# Altium project MainBoard_V2.PrjPcb
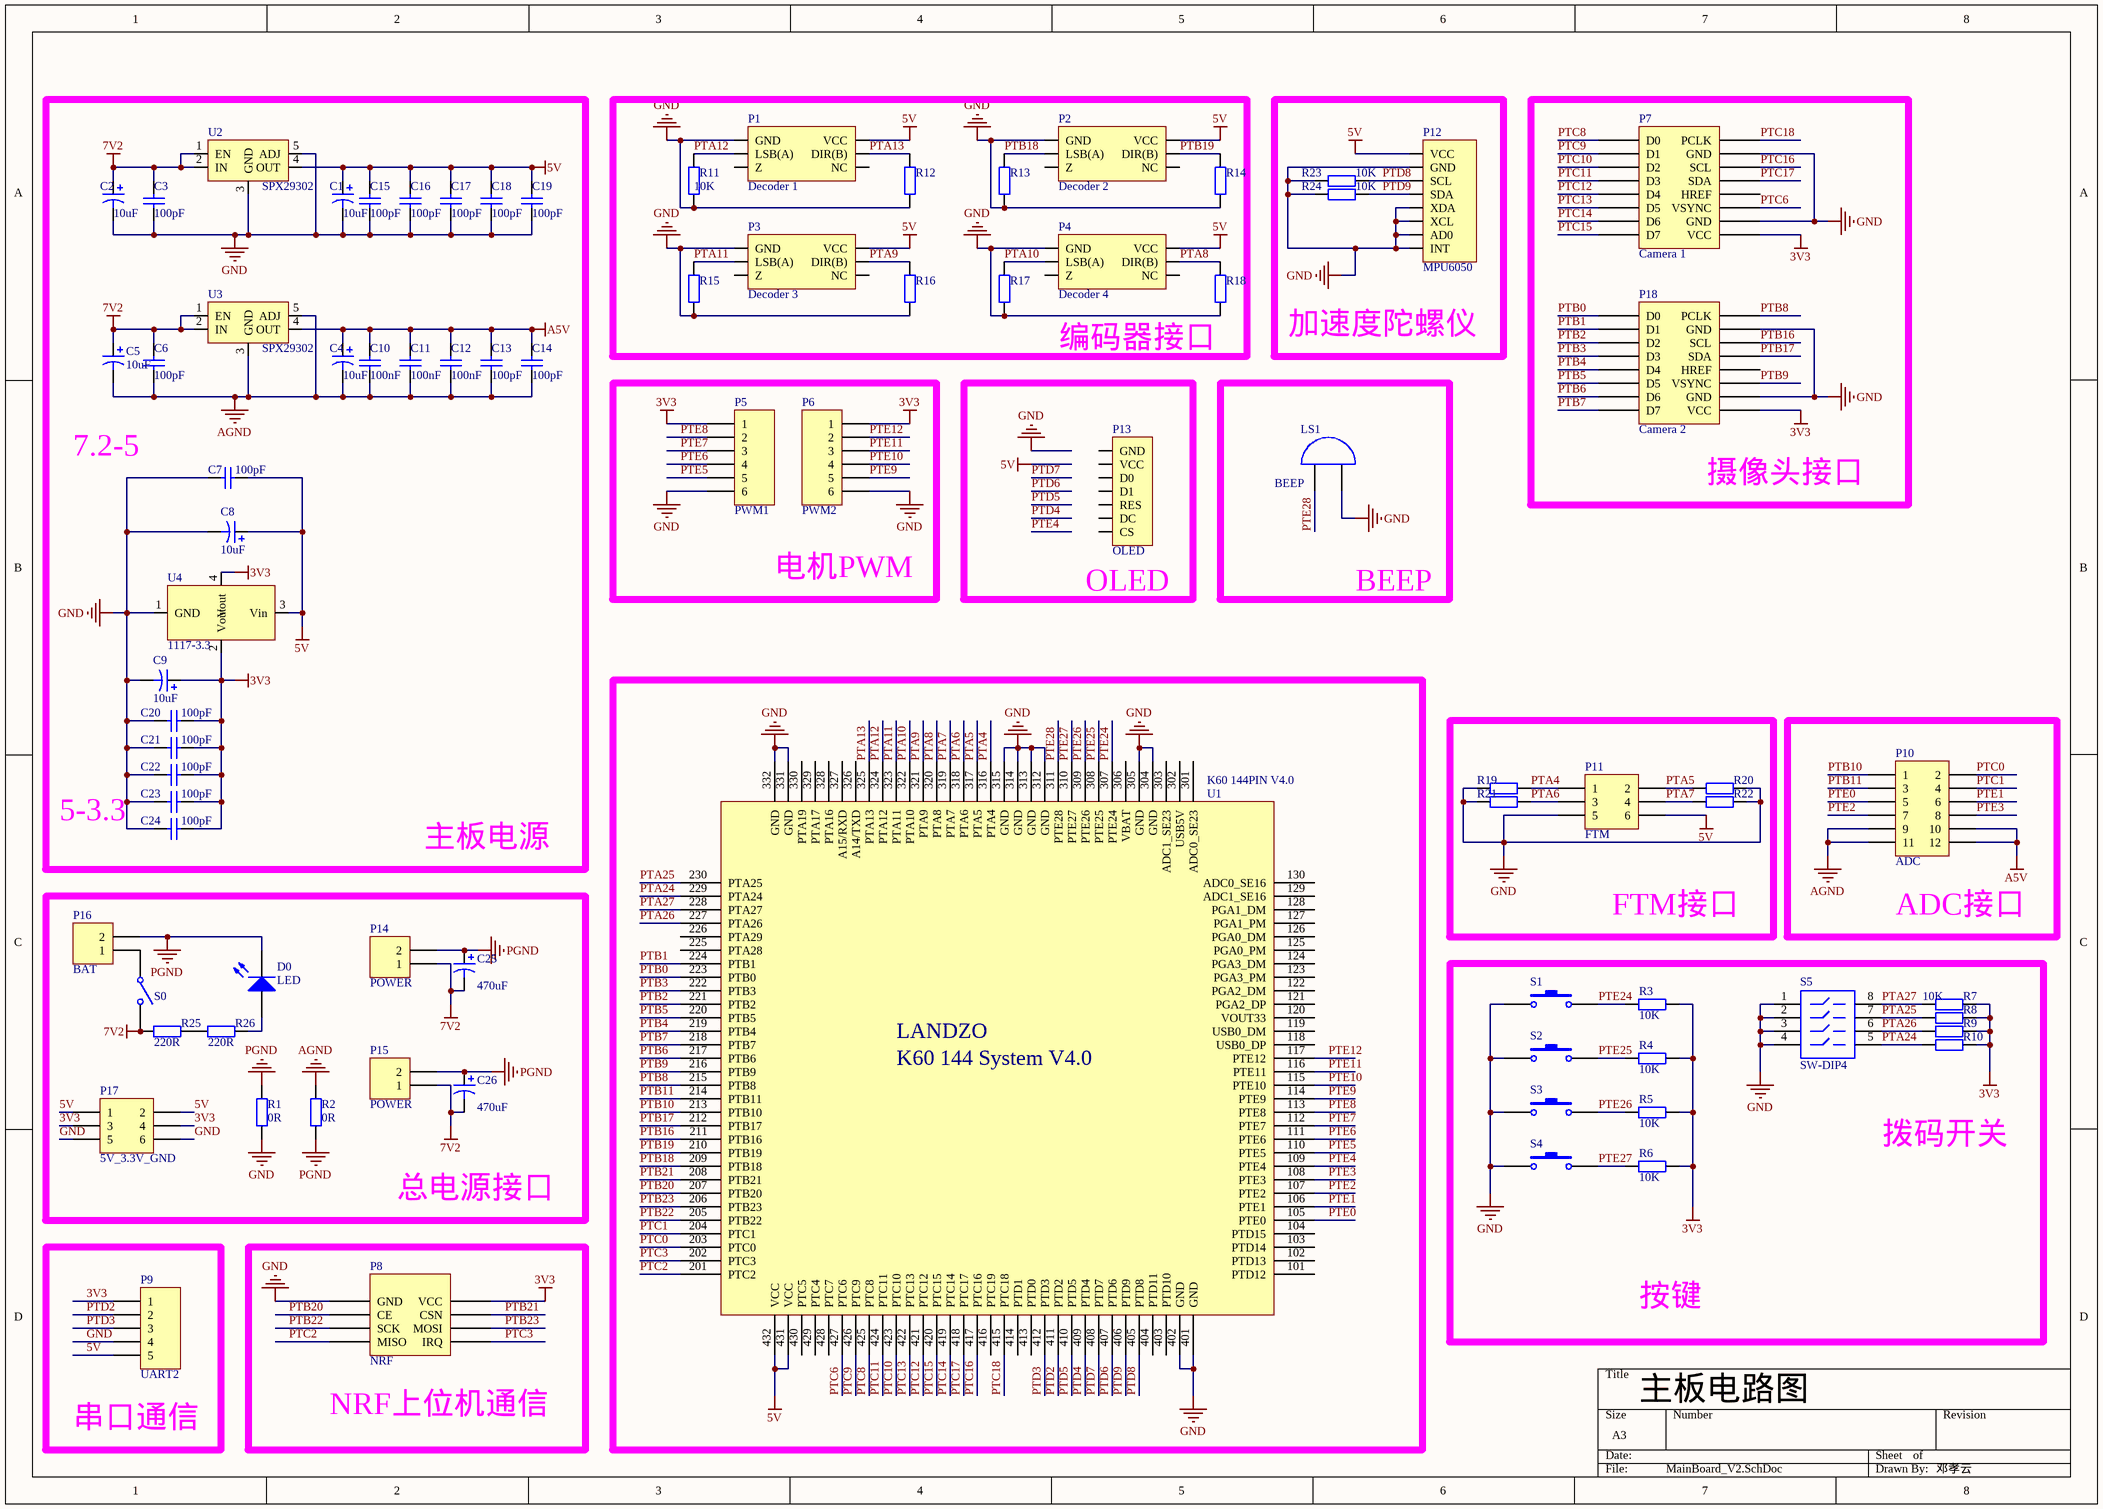
[diagram p0: MainBoard_V2.SchDoc]
1 sheet, 82 parts. Net scope: global (net labels, ports and power ports of the same name join across sheets).
Board file: MainBoard_V2.PcbDoc

## Sheet MainBoard_V2.SchDoc
size A3; PageSetup: Record=PageOptions|CenterHorizontal=True|CenterVertical=True|PrintScale=1.00|XCorrection=1.00|YCorrection=1.00|PrintKind=1|BorderSize=5000000|LeftOffset=0|BottomOffset=0|Orientation=2|PaperLength=1000|PaperWidth=1000|Scale=100|PaperSource=7|PrintQuality=-3|MediaType=1|DitherType=10|PrintScaleMode=0|PaperKind=A4|PaperIndex=9

### Parts
C1  value 10uF  [1206 C tan]  (hidden comment: Cap Pol1)
C2  value 10uF  [1206 C tan]  (hidden comment: Cap Pol1)
C3  value 100pF  [1206 C]  (hidden comment: Cap Semi)
C4  value 10uF  [1206 C tan]  (hidden comment: Cap Pol1)
C5  value 10uF  [1206 C tan]  (hidden comment: Cap Pol1)
C6  value 100pF  [1206 C]  (hidden comment: Cap Semi)
C7  value 100pF  [1206 C]  (hidden comment: Cap Semi)
C8  value 10uF  [1206 C tan]  (hidden comment: Cap Pol1)
C9  value 10uF  [1206 C tan]  (hidden comment: Cap Pol1)
C10  value 100nF  [0805 C]  (hidden comment: Cap)
C11  value 100nF  [0805 C]  (hidden comment: Cap)
C12  value 100nF  [0805 C]  (hidden comment: Cap)
C13  value 100pF  [0805 C]  (hidden comment: Cap)
C14  value 100pF  [0805 C]  (hidden comment: Cap)
C15  value 100pF  [0805 C]  (hidden comment: Cap)
C16  value 100pF  [0805 C]  (hidden comment: Cap)
C17  value 100pF  [0805 C]  (hidden comment: Cap)
C18  value 100pF  [0805 C]  (hidden comment: Cap)
C19  value 100pF  [0805 C]  (hidden comment: Cap)
C20  value 100pF  [0805 C]  (hidden comment: Cap)
C21  value 100pF  [0805 C]  (hidden comment: Cap)
C22  value 100pF  [0805 C]  (hidden comment: Cap)
C23  value 100pF  [0805 C]  (hidden comment: Cap)
C24  value 100pF  [0805 C]  (hidden comment: Cap)
C25  value 470uF  [C pol]  (hidden comment: Cap Pol1)
C26  value 470uF  [C pol]  (hidden comment: Cap Pol1)
D0  LED  [0805 D]
K60_144PIN_V4.0  U1  [K60 V4.0]
LS1  BEEP  [BEEP]
P1  Decoder 1  [BigHeader P3*2]
P2  Decoder 2  [BigHeader P3*2]
P3  Decoder 3  [BigHeader P3*2]
P4  Decoder 4  [BigHeader P3*2]
P5  PWM1  [Header P6]
P6  PWM2  [Header P6]
P7  Camera 1  [FHeader P8*2]
P8  NRF  [NRF]
P9  UART2  [Header P5]
P10  ADC  [Header P6*2]
P11  FTM  [Header P3*2]
P12  MPU6050  [MPU6050]
P13  OLED  [OLED P7]
P14  POWER  [Connect 050-2]
P15  POWER  [Connect 050-2]
P16  BAT  [Connect 050-2]
P17  5V_3.3V_GND  [Header P3*2]
P18  Camera 2  [FHeader P8*2]
R1  value 0R  [1206 R]  (hidden comment: Res2)
R2  value 0R  [1206 R]  (hidden comment: Res2)
R3  value 10K  [0805 R]  (hidden comment: Res2)
R4  value 10K  [0805 R]  (hidden comment: Res2)
R5  value 10K  [0805 R]  (hidden comment: Res2)
R6  value 10K  [0805 R]  (hidden comment: Res2)
R7  value 10K  [0805 R]  (hidden comment: Res2)
R8  Res2  [0805 R]  (value not drawn)
R9  Res2  [0805 R]  (value not drawn)
R10  Res2  [0805 R]  (value not drawn)
R11  value 10K  [0805 R]  (hidden comment: Res2)
R12  Res2  [0805 R]  (value not drawn)
R13  Res2  [0805 R]  (value not drawn)
R14  Res2  [0805 R]  (value not drawn)
R15  Res2  [0805 R]  (value not drawn)
R16  Res2  [0805 R]  (value not drawn)
R17  Res2  [0805 R]  (value not drawn)
R18  Res2  [0805 R]  (value not drawn)
R19  Res2  [0805 R]  (value not drawn)
R20  Res2  [0805 R]  (value not drawn)
R21  Res2  [0805 R]  (value not drawn)
R22  Res2  [0805 R]  (value not drawn)
R23  value 10K  [0805 R]  (hidden comment: Res2)
R24  value 10K  [0805 R]  (hidden comment: Res2)
R25  value 220R  [0805 R]  (hidden comment: Res2)
R26  value 220R  [0805 R]  (hidden comment: Res2)
S0  SW-SPST  [Switch]  (value not drawn)
S1  SW-PB  [Touch Switch]  (value not drawn)
S2  SW-PB  [Touch Switch]  (value not drawn)
S3  SW-PB  [Touch Switch]  (value not drawn)
S4  SW-PB  [Touch Switch]  (value not drawn)
S5  SW-DIP4  [DIP-8]
U2  SPX29302  [To-263-5]
U3  SPX29302  [To-263-5]
U4  1117-3.3  [SOT223_M]

### Blocks framed on the sheet
编码器接口: P1-P4 R11-R18
加速度陀螺仪: P12 R23 R24
摄像头接口: P7 P18
电机PWM: P5 P6
OLED: P13
BEEP: LS1
FTM接口: P11 R19-R22
ADC接口: P10
总电源接口: C25 C26 D0 P14-P17 R1 R2 R25 R26 S0
串口通信: P9
NRF上位机通信: P8

### Nets
3V3: C9.1 C20.2 C21.2 C22.2 C23.2 C24.2 P5.1 P6.1 P7.9(VCC) P8.8(VCC) P9.1 P17.3 P17.4 P18.9(VCC) R3.2 R4.2 R5.2 R6.2 R7.2 R8.2 R9.2 R10.2 U4.2(Vout) U4.4(Vout)
5V: C1.1 C7.2 C8.1 C15.2 C16.2 C17.2 C18.2 C19.2 K60_144PIN_V4.0.431(VCC) K60_144PIN_V4.0.432(VCC) P1.2(VCC) P2.2(VCC) P3.2(VCC) P4.2(VCC) P9.5 P11.6 P12.1(VCC) P17.1 P17.2 U2.4(OUT) U4.3(Vin)
7V2: C2.1 C3.2 C5.1 C6.2 C25.2 C26.2 P14.1 P15.1 R25.1 S0.2(NO) U2.1(EN) U2.2(IN) U3.1(EN) U3.2(IN)
A5V: C4.1 C10.2 C11.2 C12.2 C13.2 C14.2 P10.10 P10.12 U3.4(OUT)
AGND: C4.2 C5.2 C6.1 C10.1 C11.1 C12.1 C13.1 C14.1 P10.9 P10.11 R2.2 U3.3(GND) U3.5(ADJ)
GND: C1.2 C2.2 C3.1 C7.1 C8.2 C9.2 C15.1 C16.1 C17.1 C18.1 C19.1 C20.1 C21.1 C22.1 C23.1 C24.1 K60_144PIN_V4.0.304(GND) K60_144PIN_V4.0.305(GND) K60_144PIN_V4.0.312(GND) K60_144PIN_V4.0.313(GND) K60_144PIN_V4.0.314(GND) K60_144PIN_V4.0.315(GND) K60_144PIN_V4.0.331(GND) K60_144PIN_V4.0.332(GND) K60_144PIN_V4.0.401(GND) K60_144PIN_V4.0.402(GND) LS1.2(B) P1.1(GND) P2.1(GND) P3.1(GND) P4.1(GND) P5.6 P6.6 P7.10(GND) P7.15(GND) P8.1(GND) P9.4 P11.5 P12.2(GND) P12.5(XDA) P12.6(XCL) P12.7(AD0) P12.8(INT) P17.5 P17.6 P18.10(GND) P18.15(GND) R1.1 R11.1 R12.1 R13.1 R14.1 R15.1 R16.1 R17.1 R18.1 R19.1 R20.2 R21.1 R22.2 R23.1 R24.1 S1.1 S2.1 S3.1 S4.1 S5.1 S5.2 S5.3 S5.4 U2.3(GND) U2.5(ADJ) U4.1(GND)
PGND: C25.1 C26.1 D0.2(K) P14.2 P15.2 P16.2 R1.2 R2.1
PTA4: K60_144PIN_V4.0.316(PTA4) P11.1 R19.2
PTA5: K60_144PIN_V4.0.317(PTA5) P11.2 R20.1
PTA6: K60_144PIN_V4.0.318(PTA6) P11.3 R21.2
PTA7: K60_144PIN_V4.0.319(PTA7) P11.4 R22.1
PTA8: K60_144PIN_V4.0.320(PTA8) P4.4(DIR(B)) R18.2
PTA9: K60_144PIN_V4.0.321(PTA9) P3.4(DIR(B)) R16.2
PTA10: K60_144PIN_V4.0.322(PTA10) P4.3(LSB(A)) R17.2
PTA11: K60_144PIN_V4.0.323(PTA11) P3.3(LSB(A)) R15.2
PTA12: K60_144PIN_V4.0.324(PTA12) P1.3(LSB(A)) R11.2
PTA13: K60_144PIN_V4.0.325(PTA13) P1.4(DIR(B)) R12.2
PTA24: K60_144PIN_V4.0.229(PTA24) R10.1 S5.5
PTA25: K60_144PIN_V4.0.230(PTA25) R8.1 S5.7
PTA26: K60_144PIN_V4.0.227(PTA26) R9.1 S5.6
PTA27: K60_144PIN_V4.0.228(PTA27) R7.1 S5.8
PTB0: K60_144PIN_V4.0.223(PTB0) P18.1(D0)
PTB1: K60_144PIN_V4.0.224(PTB1) P18.2(D1)
PTB2: K60_144PIN_V4.0.221(PTB2) P18.3(D2)
PTB3: K60_144PIN_V4.0.222(PTB3) P18.4(D3)
PTB4: K60_144PIN_V4.0.219(PTB4) P18.5(D4)
PTB5: K60_144PIN_V4.0.220(PTB5) P18.6(D5)
PTB6: K60_144PIN_V4.0.217(PTB6) P18.7(D6)
PTB7: K60_144PIN_V4.0.218(PTB7) P18.8(D7)
PTB8: K60_144PIN_V4.0.215(PTB8) P18.16(PCLK)
PTB9: K60_144PIN_V4.0.216(PTB9) P18.11(VSYNC)
PTB10: K60_144PIN_V4.0.213(PTB10) P10.1
PTB11: K60_144PIN_V4.0.214(PTB11) P10.3
PTB16: K60_144PIN_V4.0.211(PTB16) P18.14(SCL)
PTB17: K60_144PIN_V4.0.212(PTB17) P18.13(SDA)
PTB18: K60_144PIN_V4.0.209(PTB18) P2.3(LSB(A)) R13.2
PTB19: K60_144PIN_V4.0.210(PTB19) P2.4(DIR(B)) R14.2
PTB20: K60_144PIN_V4.0.207(PTB20) P8.2(CE)
PTB21: K60_144PIN_V4.0.208(PTB21) P8.7(CSN)
PTB22: K60_144PIN_V4.0.205(PTB22) P8.3(SCK)
PTB23: K60_144PIN_V4.0.206(PTB23) P8.6(MOSI)
PTC0: K60_144PIN_V4.0.203(PTC0) P10.2
PTC1: K60_144PIN_V4.0.204(PTC1) P10.4
PTC2: K60_144PIN_V4.0.201(PTC2) P8.4(MISO)
PTC3: K60_144PIN_V4.0.202(PTC3) P8.5(IRQ)
PTC6: K60_144PIN_V4.0.427(PTC6) P7.11(VSYNC)
PTC8: K60_144PIN_V4.0.425(PTC8) P7.1(D0)
PTC9: K60_144PIN_V4.0.426(PTC9) P7.2(D1)
PTC10: K60_144PIN_V4.0.423(PTC10) P7.3(D2)
PTC11: K60_144PIN_V4.0.424(PTC11) P7.4(D3)
PTC12: K60_144PIN_V4.0.421(PTC12) P7.5(D4)
PTC13: K60_144PIN_V4.0.422(PTC13) P7.6(D5)
PTC14: K60_144PIN_V4.0.419(PTC14) P7.7(D6)
PTC15: K60_144PIN_V4.0.420(PTC15) P7.8(D7)
PTC16: K60_144PIN_V4.0.417(PTC16) P7.14(SCL)
PTC17: K60_144PIN_V4.0.418(PTC17) P7.13(SDA)
PTC18: K60_144PIN_V4.0.415(PTC18) P7.16(PCLK)
PTD2: K60_144PIN_V4.0.411(PTD2) P9.2
PTD3: K60_144PIN_V4.0.412(PTD3) P9.3
PTD4: K60_144PIN_V4.0.409(PTD4)
PTD5: K60_144PIN_V4.0.410(PTD5)
PTD6: K60_144PIN_V4.0.407(PTD6)
PTD7: K60_144PIN_V4.0.408(PTD7)
PTD8: K60_144PIN_V4.0.405(PTD8) P12.3(SCL) R23.2
PTD9: K60_144PIN_V4.0.406(PTD9) P12.4(SDA) R24.2
PTE0: K60_144PIN_V4.0.105(PTE0) P10.5
PTE1: K60_144PIN_V4.0.106(PTE1) P10.6
PTE2: K60_144PIN_V4.0.107(PTE2) P10.7
PTE3: K60_144PIN_V4.0.108(PTE3) P10.8
PTE4: K60_144PIN_V4.0.109(PTE4)
PTE5: K60_144PIN_V4.0.110(PTE5) P5.5
PTE6: K60_144PIN_V4.0.111(PTE6) P5.4
PTE7: K60_144PIN_V4.0.112(PTE7) P5.3
PTE8: K60_144PIN_V4.0.113(PTE8) P5.2
PTE9: K60_144PIN_V4.0.114(PTE9) P6.5
PTE10: K60_144PIN_V4.0.115(PTE10) P6.4
PTE11: K60_144PIN_V4.0.116(PTE11) P6.3
PTE12: K60_144PIN_V4.0.117(PTE12) P6.2
PTE24: K60_144PIN_V4.0.307(PTE24) R3.1 S1.2
PTE25: K60_144PIN_V4.0.308(PTE25) R4.1 S2.2
PTE26: K60_144PIN_V4.0.309(PTE26) R5.1 S3.2
PTE27: K60_144PIN_V4.0.310(PTE27) R6.1 S4.2
PTE28: K60_144PIN_V4.0.311(PTE28) LS1.1(A)
NetD0_1: D0.1(A) R26.2
NetP16_1: P16.1 S0.1(COMMON)
NetR25_2: R25.2 R26.1

Not connected (* = marked no-connect by the designer): K60_144PIN_V4.0 101(PTD12) 102(PTD13) 103(PTD14) 104(PTD15) 118(USB0_DP) 119(USB0_DM) 120(VOUT33) 121(PGA2_DP) 122(PGA2_DM) 123(PGA3_PM) 124(PGA3_DM) 125(PGA0_PM) 126(PGA0_DM) 127(PGA1_PM) 128(PGA1_DM) 129(ADC1_SE16) 130(ADC0_SE16) 225(PTA28) 226(PTA29) 301(ADC0_SE23) 302(USB5V) 303(ADC1_SE23) 306(VBAT) 326(A14/TXD) 327(A15/RXD) 328(PTA16) 329(PTA17) 330(PTA19) 403(PTD10) 404(PTD11) 413(PTD0) 414(PTD1) 416(PTC19) 428(PTC7) 429(PTC4) 430(PTC5); P1 5(Z) 6(NC); P2 5(Z) 6(NC); P3 5(Z) 6(NC); P4 5(Z) 6(NC); P7 12(HREF); P13 1(GND) 2(VCC) 3(D0) 4(D1) 5(RES) 6(DC) 7(CS); P18 12(HREF)

### Notes on the sheet
- 7.2-5
- 5-3.3
- 主板电源
- 拨码开关
- 按键
- 主板电路图
- 邓孝云
- (in symbol K60 144PIN V4.0系统板) LANDZO; K60 144 System V4.0

### Library data of the parts
C1 C2 C4 C5 C8 C9 C25 C26 = Cap Pol1: Polarized Capacitor (Radial); Published: 8-Jun-2000; LatestRevisionDate: 17-Jul-2002; LatestRevisionNote: Re-released for DXP Platform.; PackageReference: RB7.6-15; Publisher: Altium Limited; PackageDescription: Polarized Capacitor (Radial); 2 Leads
C3 C6 C7 = Cap Semi: Capacitor (Semiconductor SIM Model); Published: 8-Jun-2000; LatestRevisionDate: 29-May-2009; LatestRevisionNote: IPC-7351 Footprint Added.; PackageReference: C1206; Publisher: Altium Limited; PackageDescription: Chip Capacitor
C10-C24 = Cap: Capacitor; Published: 8-Jun-2000; LatestRevisionDate: 17-Jul-2002; LatestRevisionNote: Re-released for DXP Platform.; PackageReference: RAD-0.3; Publisher: Altium Limited; PackageDescription: Radial Cap, Thru-Hole; 2 Leads; 0.3 in Pin Spacing
D0 = LED0: Typical INFRARED GaAs LED; Published: 8-Jun-2000; LatestRevisionDate: 08-Jul-2005; LatestRevisionNote: Mech Layer 1 removed.; PackageReference: LED-0; Publisher: Altium Limited; PackageDescription: LED; 2 Leads
K60_144PIN_V4.0 = K60 144PIN V4.0系统板: Vcc5V。网标x代表排针。USB5V供外接USB使用的，不推荐使用。VBAT是给另一个晶振使用的，使用3.3V，可以不接。
LS1 = Bell: Electrical Bell; Published: 24-Mar-1999; LatestRevisionDate: 17-Jul-2002; LatestRevisionNote: Re-released for DXP Platform.; PackageReference: PIN2; Publisher: Altium Limited
P1-P4 = Decoder: Header-6
P5 P6 = Header 6: Header, 6-Pin; LatestRevisionDate: 17-Jul-2002; LatestRevisionNote: Re-released for DXP Platform.; Publisher: Altium Limited
P7 P18 = OV7725: 3.3V
P9 = Header 5: Header, 5-Pin; LatestRevisionDate: 17-Jul-2002; LatestRevisionNote: Re-released for DXP Platform.; Publisher: Altium Limited
P10 = Header 6X2: Header, 6-Pin, Dual row; LatestRevisionDate: 17-Jul-2002; LatestRevisionNote: Re-released for DXP Platform.; Publisher: Altium Limited
P11 P17 = Header 3X2: Header, 3-Pin, Dual row; LatestRevisionDate: 17-Jul-2002; LatestRevisionNote: Re-released for DXP Platform.; Publisher: Altium Limited
P12 = MPU6050: Header-8
P13 = OLED: Header-7
P14-P16 = Header 2: Header, 2-Pin
R1-R7 R11 R23-R26 = Res2: Resistor; Published: 8-Jun-2000; LatestRevisionDate: 17-Jul-2002; LatestRevisionNote: Re-released for DXP Platform.; PackageReference: AXIAL-0.4; Publisher: Altium Limited; PackageDescription: Axial Device, Thru-Hole; 2 Leads; 0.4 in Pin Spacing
R8-R10 R12-R22 = Res2: Resistor; Value: 10K; Published: 8-Jun-2000; LatestRevisionDate: 17-Jul-2002; LatestRevisionNote: Re-released for DXP Platform.; PackageReference: AXIAL-0.4; Publisher: Altium Limited; PackageDescription: Axial Device, Thru-Hole; 2 Leads; 0.4 in Pin Spacing
S0 = SW-SPST: Single-Pole, Single-Throw Switch; Published: 24-Mar-1999; LatestRevisionDate: 17-Jul-2002; LatestRevisionNote: Re-released for DXP Platform.; PackageReference: SPST-2; Publisher: Altium Limited; PackageDescription: Switch; 2 Leads
S1-S4 = SW-PB: Switch; Published: 24-Mar-1999; LatestRevisionDate: 17-Jul-2002; LatestRevisionNote: Re-released for DXP Platform.; PackageReference: SPST-2; Publisher: Altium Limited; PackageDescription: Switch; 2 Leads
S5 = SW-DIP4: DIP Switch; Published: 24-Mar-1999; LatestRevisionDate: 17-Jul-2002; LatestRevisionNote: Re-released for DXP Platform.; PackageReference: DIP-8; Publisher: Altium Limited
U4 = 1117